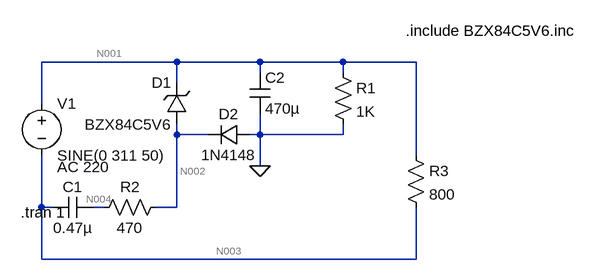
[diagram p0: schematic power_supply.asc]
power_supply.asc, the LTspice schematic file:
Version 4
SHEET 1 1412 740
WIRE 240 48 32 48
WIRE 368 48 240 48
WIRE 496 48 368 48
WIRE 608 48 496 48
WIRE 368 64 368 48
WIRE 496 64 496 48
WIRE 240 80 240 48
WIRE 32 112 32 48
WIRE 240 160 240 144
WIRE 288 160 240 160
WIRE 368 160 368 128
WIRE 368 160 352 160
WIRE 496 160 496 144
WIRE 496 160 368 160
WIRE 608 192 608 48
WIRE 368 208 368 160
WIRE 32 272 32 192
WIRE 48 272 32 272
WIRE 128 272 112 272
WIRE 240 272 240 160
WIRE 240 272 208 272
WIRE 32 352 32 272
WIRE 608 352 608 272
WIRE 608 352 32 352
FLAG 368 208 0
SYMBOL voltage 32 96 R0
WINDOW 123 24 114 Left 2
WINDOW 39 0 0 Left 2
SYMATTR Value2 AC 220
SYMATTR InstName V1
SYMATTR Value SINE(0 311 50)
SYMBOL diode 352 144 R90
WINDOW 0 0 32 VBottom 2
WINDOW 3 32 32 VTop 2
SYMATTR InstName D2
SYMATTR Value 1N4148
SYMBOL cap 48 288 R270
WINDOW 0 32 32 VTop 2
WINDOW 3 0 32 VBottom 2
SYMATTR InstName C1
SYMATTR Value 0.47µ
SYMATTR SpiceLine V=400
SYMBOL cap 352 64 R0
SYMATTR InstName C2
SYMATTR Value 470µ
SYMATTR SpiceLine V=16
SYMBOL res 480 48 R0
SYMATTR InstName R1
SYMATTR Value 1K
SYMBOL zener 256 144 R180
WINDOW 0 24 64 Left 2
WINDOW 3 24 0 Left 2
SYMATTR InstName D1
SYMATTR Value BZX84C5V6
SYMATTR Prefix X
SYMBOL res 112 288 R270
WINDOW 0 32 56 VTop 2
WINDOW 3 0 56 VBottom 2
SYMATTR InstName R2
SYMATTR Value 470
SYMBOL res 592 176 R0
SYMATTR InstName R3
SYMATTR Value 800
TEXT 592 0 Left 2 !.include BZX84C5V6.inc
TEXT 0 280 Left 2 !.tran 1

The netlist it stands for:
* power_supply.asc
V1 N001 N003 SINE(0 311 50) AC 220
D2 0 N002 1N4148
C1 N003 N004 0.47µ V=400
C2 N001 0 470µ V=16
R1 N001 0 1K
XD1 N002 N001 BZX84C5V6  ; pins + -
R2 N004 N002 470
R3 N001 N003 800
.model D D
.lib standard.dio
.include BZX84C5V6.inc
.tran 1
.backanno
.end

* Results of the author's LTspice run, read from the files saved beside the schematic
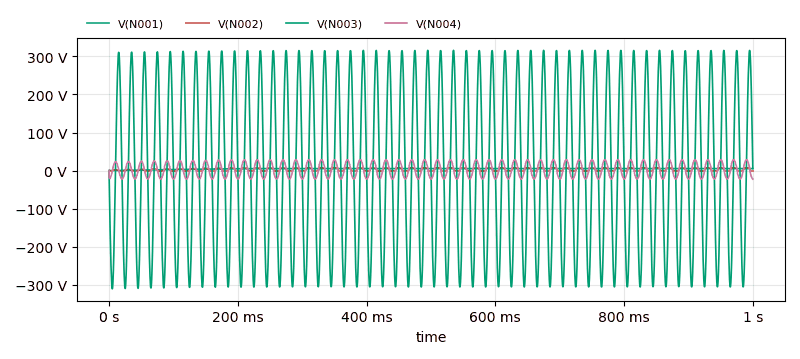
[diagram p1: Transient Analysis of power_supply.asc, plotted from the saved traces]
* Transient Analysis, 1 run:
*   V(N001): min 0 V, max 5.481 V, average 4.844 V, rms 5.005 V, last 5.408 V
*   V(N002): min -782.8 mV, max 7.53 V, average 2.871 V, rms 4.602 V, last -739.6 mV
*   V(N003): min -310.2 V, max 315.8 V, average 4.586 V, rms 219.2 V, last 5.408 V
*   V(N004): min -22.26 V, max 28.74 V, average 2.857 V, rms 18.51 V, last -22.26 V